# EAGLE design G879X (EAGLE 6.6.0)
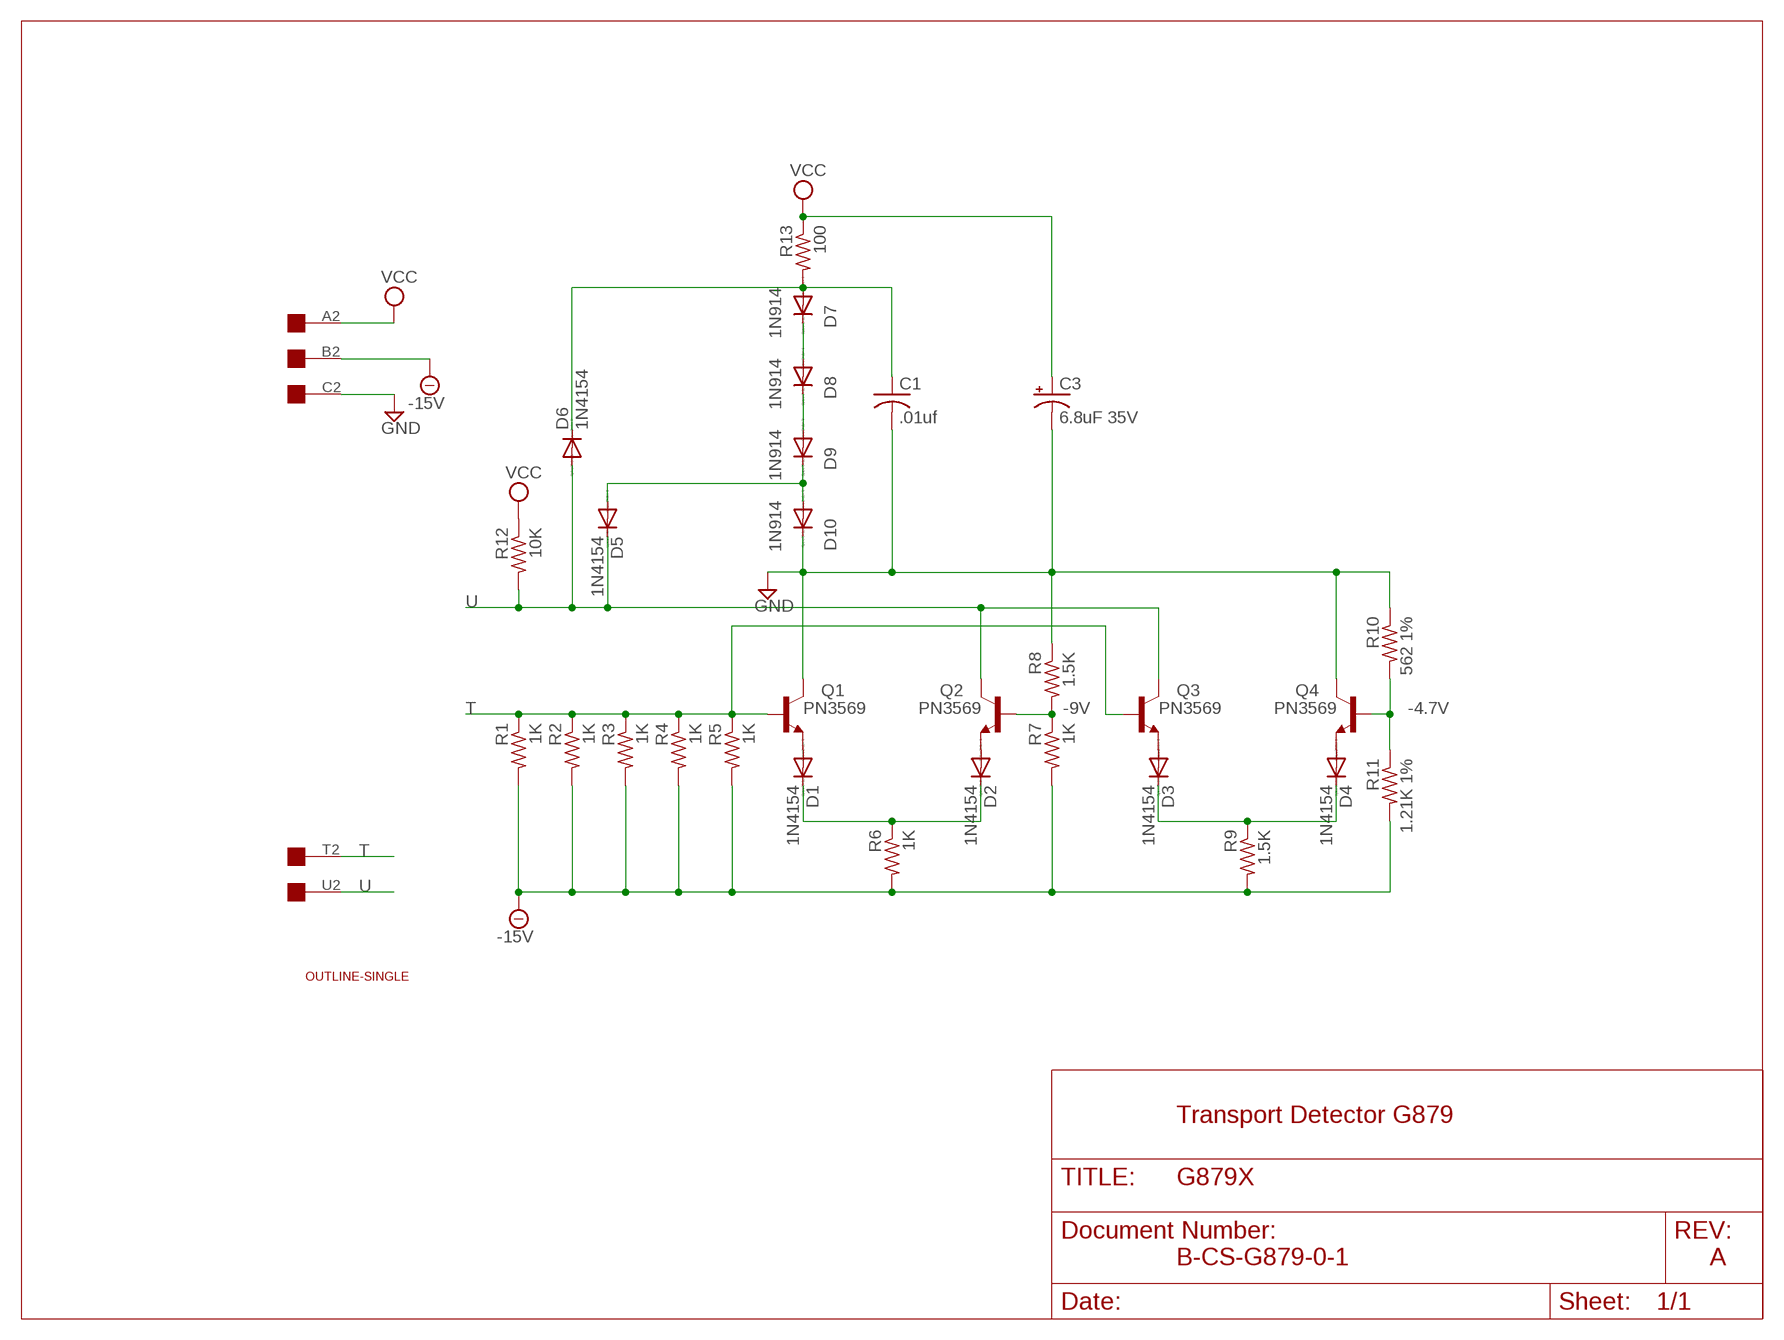
[diagram p0: schematic, sheet 1]

## Parts
C1  .01uf  C-US050-025X075  [C050-025X075]
C3  6.8uF 35V  CPOL-USE20-8AXIAL  [E12-8]
D1  1N4154  1N4004  [DO41-10]
D2  1N4154  1N4004  [DO41-10]
D3  1N4154  1N4004  [DO41-10]
D4  1N4154  1N4004  [DO41-10]
D5  1N4154  1N4004  [DO41-10]
D6  1N4154  1N4004  [DO41-10]
D7  1N914  1N4004  [DO41-10]
D8  1N914  1N4004  [DO41-10]
D9  1N914  1N4004  [DO41-10]
D10  1N914  1N4004  [DO41-10]
Q1  PN3569  2N1711  [TO39]
Q2  PN3569  2N1711  [TO39]
Q3  PN3569  2N1711  [TO39]
Q4  PN3569  2N1711  [TO39]
R1  1K  R-US_0207/10  [0207/10]
R2  1K  R-US_0207/10  [0207/10]
R3  1K  R-US_0207/10  [0207/10]
R4  1K  R-US_0207/10  [0207/10]
R5  1K  R-US_0207/10  [0207/10]
R6  1K  R-US_0207/10  [0207/10]
R7  1K  R-US_0207/10  [0207/10]
R8  1.5K  R-US_0207/10  [0207/10]
R9  1.5K  R-US_0207/10  [0207/10]
R10  562 1%  R-US_0207/15  [0207/15]
R11  1.21K 1%  R-US_0207/15  [0207/15]
R12  10K  R-US_0207/10  [0207/10]
R13  100  R-US_0207/10  [0207/10]
U$1  EDGE-1  [EDGE-CON1]
U$2  OUTLINE-SINGLE  [SINGLE]

## Nets
-4.7V: Q4.2(B) R10.2 R11.1
-9V: Q2.2(B) R7.1 R8.2
-15V: R1.2 R2.2 R3.2 R4.2 R5.2 R6.2 R7.2 R9.2 R11.2 U$1.B2
GND: C1.2 C3.- D10.C Q1.3(C) Q4.3(C) R8.1 R10.1 U$1.C2
N$1: D1.A Q1.1(E)
N$2: D3.C D4.C R9.1
N$3: D2.A Q2.1(E)
N$4: D4.A Q4.1(E)
N$5: D5.A D9.C D10.A
N$6: D1.C D2.C R6.1
N$7: D8.C D9.A
N$8: D3.A Q3.1(E)
N$9: D7.C D8.A
N$10: C1.1 D6.C D7.A R13.2
T: Q1.2(B) Q3.2(B) R1.1 R2.1 R3.1 R4.1 R5.1 U$1.T2
U: D5.C D6.A Q2.3(C) Q3.3(C) R12.2 U$1.U2
VCC: C3.+ R12.1 R13.1 U$1.A2
Unconnected: U$1.D2 U$1.E2 U$1.F2 U$1.H2 U$1.J2 U$1.K2 U$1.L2 U$1.M2 U$1.N2 U$1.P2 U$1.R2 U$1.S2 U$1.V2

## Notes on the sheet
- Transport Detector G879
- B-CS-G879-0-1 | A

## Library data of the parts
C1 = rcl:C-US: CAPACITOR, American symbol
C3 = dec-con:CPOL-USE20-8AXIAL: A 0.8 inch electrolytic.
D1-D10 = diode:1N4004: DIODE general purpose rectifier, 1 A
Q1-Q4 = transistor-npn:2N1711: NPN Transistor
R1-R13 = rcl:R-US_: RESISTOR, American symbol
U$1 = dec-con:EDGE-1: Single-Sided DEC Edge Connector -- (side 2)
U$2 = dec-con:OUTLINE-*: Board outlines for DEC boards.

## Board
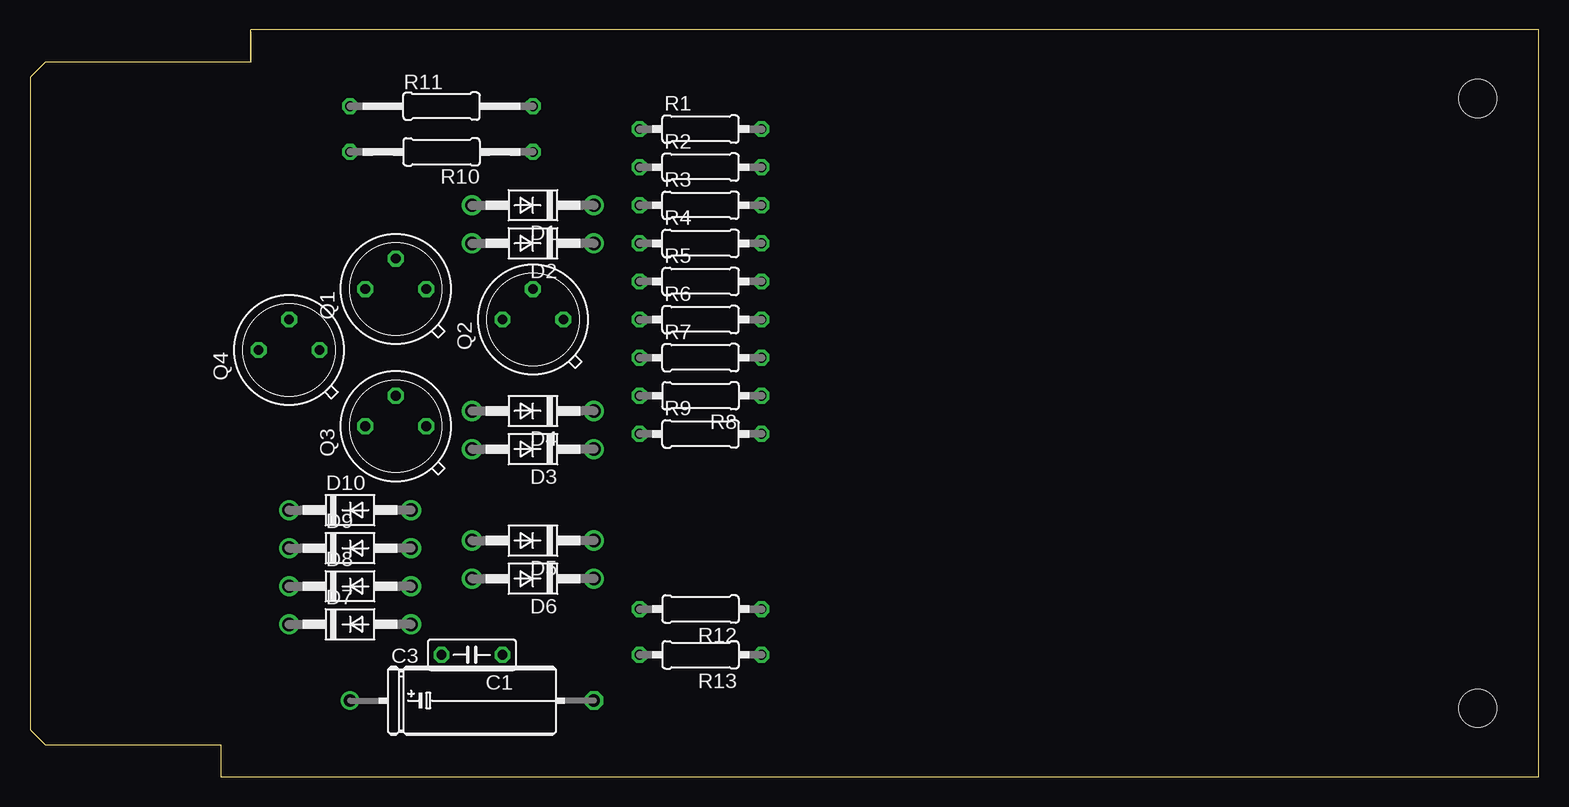
[diagram p1: board, top side]
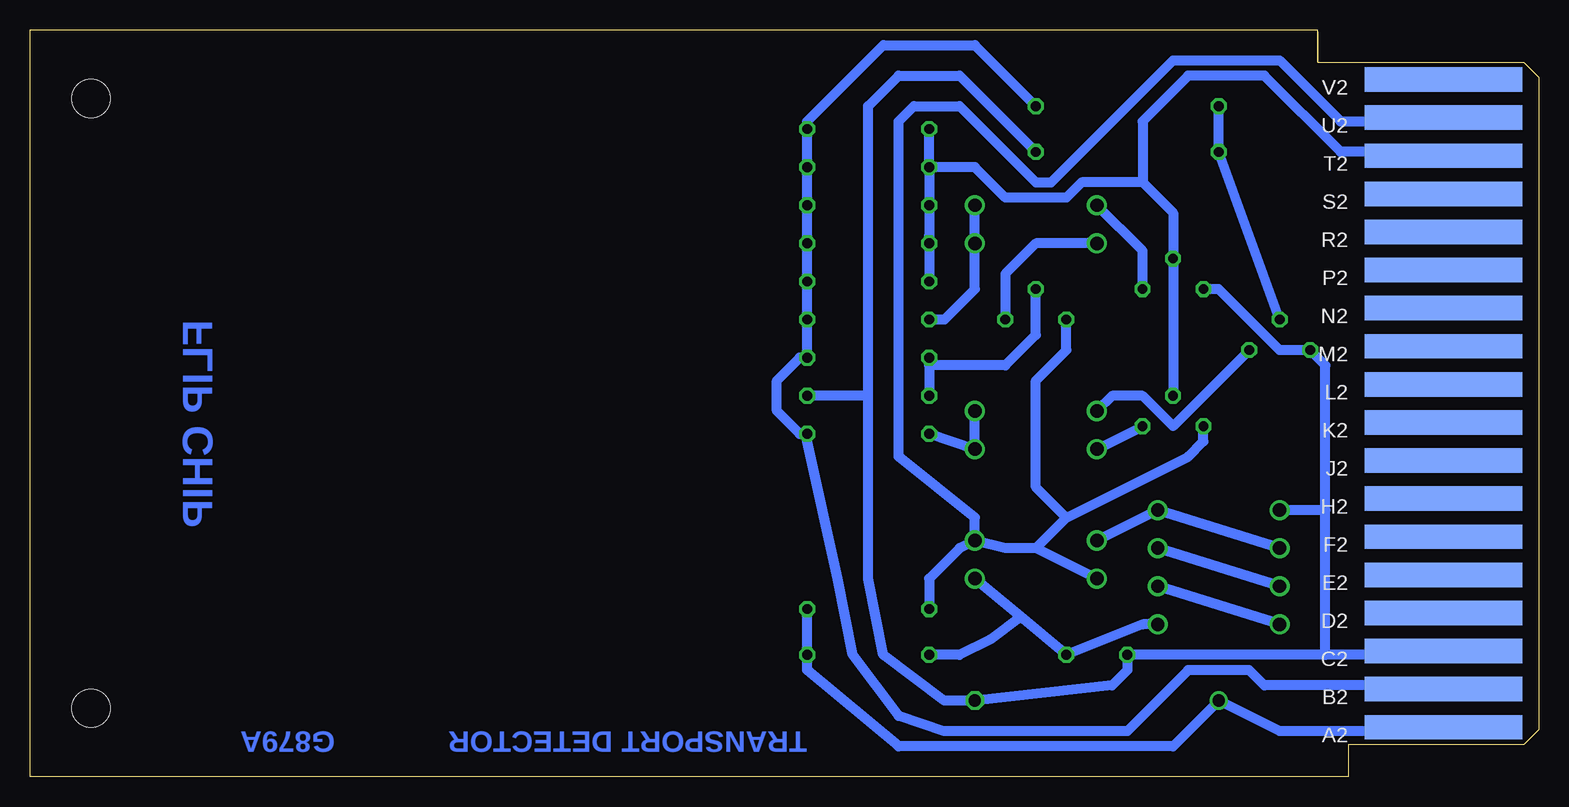
[diagram p2: board, bottom side, seen from below]

Size 125.73 x 62.23 mm. Coordinates in mm from the lower left corner, seen from the top.
Copper layers (1+16): Top 0.035mm / dielectric 1.5mm / Bottom 0.035mm
Design rules "16mils": minimum track width 16mil, minimum drill 32mil, track to track 15mil, track to pad 10mil, pad to pad 10mil, via to via 10mil, smd to smd 10mil, copper to edge 13mil, drill to drill 10mil, minimum pad ring 10mil, minimum via ring 8mil, stop-mask expansion 0mil, vias tented up to drill 0mil, thermal gap 10mil

### Footprints (pad centres in the part's own frame; a part is rotated, then mirrored left to right if it is on the bottom)
C050-025X075 = drill 0.813 octagon: 1 -2.54,0; 2 2.54,0
E12-8 = drill 1.016: + -10.16,0 | drill 1.016 octagon: - 10.16,0
DO41-10 = drill 1.118: A 5.08,0; C -5.08,0
TO39 = drill 0.813 octagon: 1 0,-2.54; 2 2.54,0; 3 0,2.54
0207/10 = drill 0.813 octagon: 1 -5.08,0; 2 5.08,0
0207/15 = drill 0.813 octagon: 1 -7.62,0; 2 7.62,0
EDGE-CON1 = smd 13.106 x 2.032 bottom: A2 7.938,4.128; B2 7.938,7.303; C2 7.938,10.477; D2 7.938,13.652; E2 7.938,16.828; F2 7.938,20.003; H2 7.938,23.177; J2 7.938,26.352; K2 7.938,29.527; L2 7.938,32.703; M2 7.938,35.877; N2 7.938,39.053; P2 7.938,42.227; R2 7.938,45.403; S2 7.938,48.578; T2 7.938,51.752; U2 7.938,54.928; V2 7.938,58.102
SINGLE = hole 3.175: 120.65,56.515; 120.65,5.715

### Placement (x,y rotation side)
C1  36.83,10.16 180 top
C3  36.83,6.35 0 top
D1  41.91,47.62 180 top
D2  41.91,44.45 180 top
D3  41.91,27.3 180 top
D4  41.91,30.48 180 top
D5  41.91,19.68 180 top
D6  41.91,16.51 180 top
D7  26.67,12.7 0 top
D8  26.67,15.88 0 top
D9  26.67,19.05 0 top
D10  26.67,22.23 0 top
Q1  30.48,40.64 90 top
Q2  41.91,38.1 90 top
Q3  30.48,29.21 90 top
Q4  21.59,35.56 90 top
R1  55.88,53.98 0 top
R2  55.88,50.8 0 top
R3  55.88,47.62 0 top
R4  55.88,44.45 0 top
R5  55.88,41.27 0 top
R6  55.88,38.1 0 top
R7  55.88,34.92 0 top
R8  55.88,31.75 180 top
R9  55.88,28.57 0 top
R10  34.29,52.07 180 top
R11  34.29,55.88 0 top
R12  55.88,13.97 180 top
R13  55.88,10.16 180 top
U$1  0,0 0 top
U$2  0,0 0 top

### Tracks (layer width: path | path; a pad name or v marks a point on that pad's centre or on a via)
-4.7V
  Bottom 0.813: Q4.2 R10.2 R11.1
-9V
  Bottom 0.813: 50.8,34.29 R8.2 | 50.8,34.29 R7.1 | Q2.2 41.91,36.83 44.45,34.29 50.8,34.29
-15V
  Bottom 0.813: R11.2 46.99,60.96 54.61,60.96 60.96,54.61 R1.2 R2.2 R3.2 R4.2 R5.2 R6.2 R7.2 61.6,34.92 63.5,33.02 63.5,30.48 61.6,28.57 R9.2 60.96,27.94 58.42,16.51 57.15,10.16 53.34,5.08 49.53,3.81 34.29,3.81 29.21,8.89 24.13,8.89 22.86,7.62 8.89,7.62 U$1.B2
GND
  Bottom 0.813: 17.78,22.23 D10.C | 17.78,22.23 17.78,34.29 Q4.3 21.59,35.56 26.67,40.64 Q1.3 | R10.1 48.26,58.42 53.34,58.42 55.88,55.88 55.88,31.75 | 55.88,31.75 55.88,16.51 54.61,10.16 49.53,6.35 C3.- 35.56,7.62 34.29,8.89 C1.2 17.78,10.16 | 55.88,31.75 R8.1 | U$1.C2 8.89,10.16 17.78,10.16 | 17.78,10.16 17.78,22.23
N$1
  Bottom 0.813: Q1.1 33.02,43.81 D1.A
N$2
  Bottom 0.813: D4.C D3.C R9.1
N$3
  Bottom 0.813: D2.A 41.91,44.45 44.45,41.91 Q2.1
N$4
  Bottom 0.813: D4.A 35.56,31.75 33.02,31.75 30.48,29.21 Q4.1
N$5
  Bottom 0.813: D9.C D10.A D5.A
N$6
  Bottom 0.813: R6.1 49.53,38.1 46.99,40.64 D2.C D1.C
N$7
  Bottom 0.813: D8.C D9.A
N$8
  Bottom 0.813: D3.A Q3.1
N$9
  Bottom 0.813: D7.C D8.A
N$10
  Bottom 0.813: 43.18,13.34 C1.1 33.02,12.7 D7.A | 43.18,13.34 D6.C | R13.2 48.26,10.16 45.72,11.43 43.18,13.34
T
  Bottom 0.813: R4.1 R5.1 | R4.1 50.8,45.09 | R4.1 R3.1 R2.1 | R2.1 R1.1 | U$1.T2 8.26,52.07 16.51,52.07 22.86,58.42 29.21,58.42 33.02,54.61 33.02,49.53 | 33.02,49.53 30.48,46.99 Q1.2 Q3.2 | 33.02,49.53 38.1,49.53 39.37,48.26 44.45,48.26 46.99,50.8 R2.1
U
  Bottom 0.813: U$1.U2 8.26,54.61 16.51,54.61 21.59,59.69 30.48,59.69 40.64,49.53 41.91,49.53 48.26,55.88 52.07,55.88 53.34,54.61 53.34,26.67 46.99,21.59 D5.C | Q3.3 27.94,27.94 29.21,26.67 39.37,21.59 | Q2.3 39.37,35.56 41.91,33.02 41.91,24.13 39.37,21.59 | R12.2 50.8,16.51 48.26,19.05 D5.C | D5.C 44.45,19.05 41.91,19.05 | 41.91,19.05 39.37,21.59 | D6.A 41.91,19.05
VCC
  Bottom 0.813: U$1.A2 8.89,3.81 21.59,3.81 C3.+ 30.48,2.54 53.34,2.54 60.96,8.89 R13.1 R12.1

### Text on the board
Bottom: FLIP CHIP | TRANSPORT DETECTOR | G879A